# EAGLE design BrakeStrobeLights (EAGLE 8.1.0)
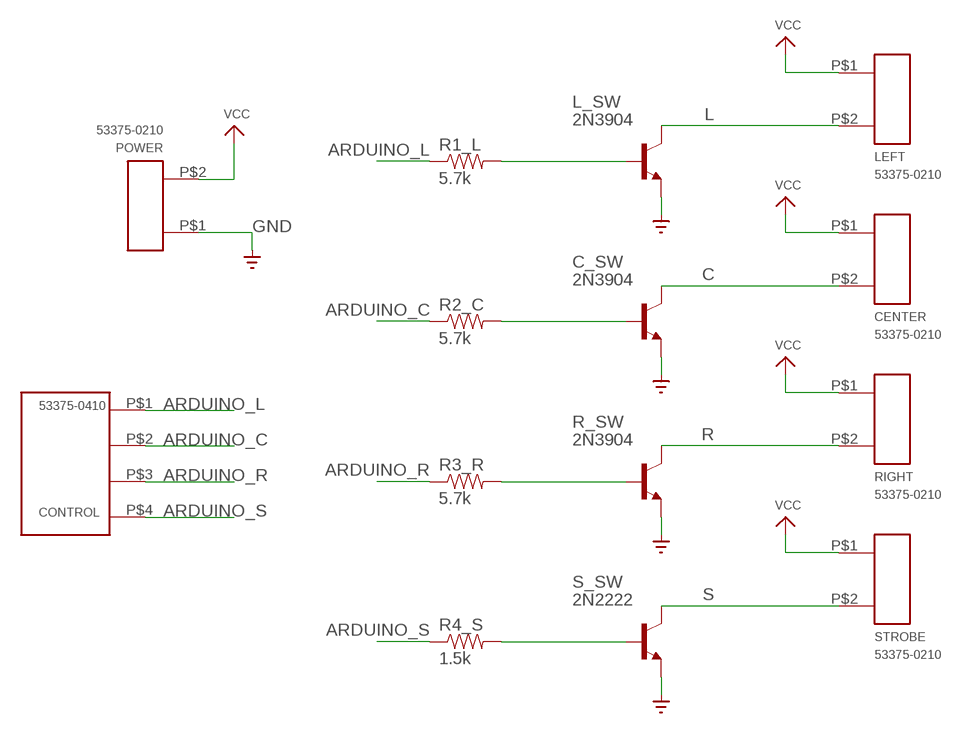
[diagram p0: schematic, sheet 1]

## Parts
C_SW  2N3904  [TO92]
CENTER  53375-0210  [53375-0210-MINI-LOCK]
CONTROL  53375-0410  [53375-0410-MINI-LOCK]
L_SW  2N3904  [TO92]
LEFT  53375-0210  [53375-0210-MINI-LOCK]
POWER  53375-0210  [53375-0210-MINI-LOCK]
R1_L  5.7k  RESISTORPTH-1/6W  [1/6W-RES]
R2_C  5.7k  RESISTORPTH-1/6W  [1/6W-RES]
R3_R  5.7k  RESISTORPTH-1/6W  [1/6W-RES]
R4_S  1.5k  RESISTORPTH-1/6W  [1/6W-RES]
R_SW  2N3904  [TO92]
RIGHT  53375-0210  [53375-0210-MINI-LOCK]
S_SW  2N2222  [TO92-EBC-OVAL]
STROBE  53375-0210  [53375-0210-MINI-LOCK]

## Nets
ARDUINO_C: CONTROL.P$2 R2_C.1
ARDUINO_L: CONTROL.P$1 R1_L.1
ARDUINO_R: CONTROL.P$3 R3_R.1
ARDUINO_S: CONTROL.P$4 R4_S.1
C: C_SW.1(C) CENTER.P$2
GND: C_SW.3(E) L_SW.3(E) POWER.P$1 R_SW.3(E) S_SW.E ; supply symbol labelled GND_
L: L_SW.1(C) LEFT.P$2
N$1: R3_R.2 R_SW.2(B)
N$2: C_SW.2(B) R2_C.2
N$3: R4_S.2 S_SW.B
N$4: L_SW.2(B) R1_L.2
R: R_SW.1(C) RIGHT.P$2
S: S_SW.C STROBE.P$2
VCC: CENTER.P$1 LEFT.P$1 POWER.P$2 RIGHT.P$1 STROBE.P$1

## Library data of the parts
C_SW L_SW R_SW = transistor:2N3904: NPN TRANSISTOR
CENTER LEFT POWER RIGHT STROBE = Hooman:53375-0210: Mini-Lock Header 2 pin 53375 series
CONTROL = Hooman:53375-0410: Mini-Lock Header 4 pin 53375 series
R1_L R2_C R3_R R4_S = SparkFun-Resistors:RESISTOR: Resistor Basic schematic elements and footprints for 0603, 1206, and PTH resistors.
S_SW = adafruit:2N2222: NPN TRANSISTOR Big oval pads

## Board
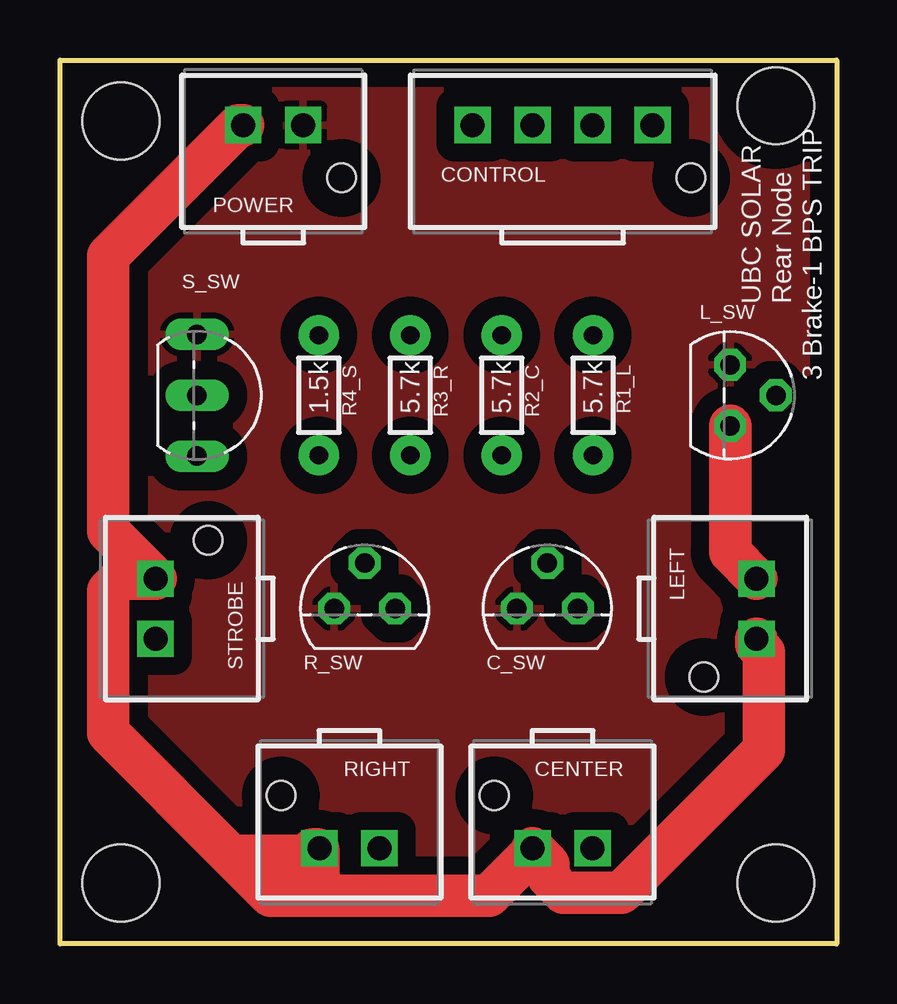
[diagram p1: board, top side]
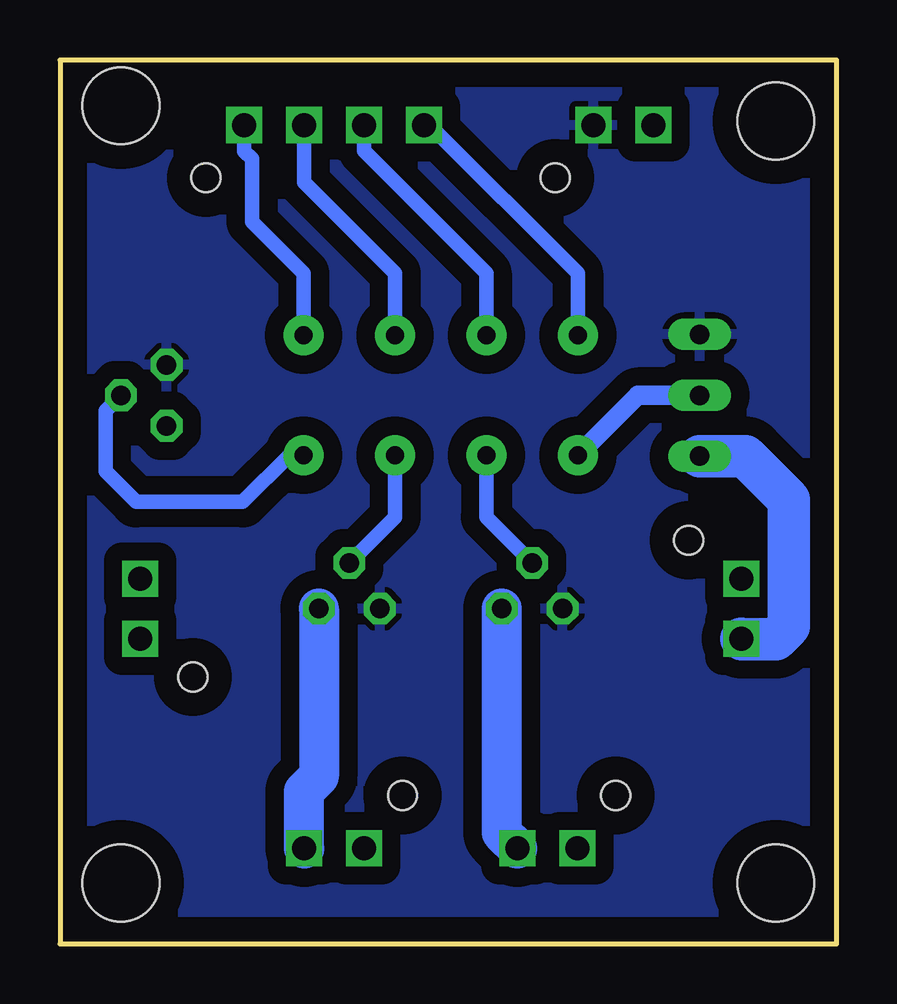
[diagram p2: board, bottom side, seen from below]

Size 32.38 x 36.83 mm. Coordinates in mm from the lower left corner, seen from the top.
Outline: 0,0 0,36.83 32.38,36.83 32.38,0 0,0
Copper layers (1*16): Top 0.035mm / dielectric 1.5mm / Bottom 0.035mm
Design rules "default": minimum track width 10mil, minimum drill 24mil, track to track 8mil, track to pad 8mil, pad to pad 8mil, via to via 8mil, smd to smd 8mil, copper to edge 40mil, drill to drill 8mil, minimum pad ring 10mil, minimum via ring 8mil, stop-mask expansion 4mil, vias tented up to drill 0mil, thermal gap 10mil
Holes 3.2 mm at 29.84,2.54 2.54,2.54 2.54,34.29 29.84,34.92
tKeepout: area 0,36.8 to 33,38.1; area 32.4,0 to 33.7,38.1; area -1.3,0 to 0,38.1; area -1.3,-1.3 to 33.7,0

### Footprints (pad centres in the part's own frame; a part is rotated, then mirrored left to right if it is on the bottom)
TO92 = drill 0.813 octagon: 1 1.27,0; 2 0,1.905; 3 -1.27,0
53375-0210-MINI-LOCK = drill 1 square: P$1 1.25,1.1; P$2 -1.25,1.1 | hole 1.2: 2.85,-1.1
53375-0410-MINI-LOCK = drill 1 square: P$1 3.75,1.1; P$2 1.25,1.1; P$3 -1.25,1.1; P$4 -3.75,1.1 | hole 1.2: 5.35,-1.1
1/6W-RES = drill 0.762 pad 1.676: 1 -2.5,0; 2 2.5,0
TO92-EBC-OVAL = drill 0.813 long: B 0,-1.27; C 2.54,-1.27; E -2.54,-1.27

### Placement (x,y rotation side)
C_SW  20.32,13.97 0 top
CENTER  20.95,5.08 180 top
CONTROL  20.95,33.02 0 top
L_SW  27.94,22.86 270 top
LEFT  27.94,13.97 270 top
POWER  8.89,33.02 0 top
R1_L  22.23,22.86 270 top
R2_C  18.41,22.86 270 top
R3_R  14.61,22.86 270 top
R4_S  10.79,22.86 270 top
R_SW  12.7,13.97 0 top
RIGHT  12.06,5.08 180 top
S_SW  6.99,22.86 270 top
STROBE  5.08,13.97 90 top

### Tracks (layer width: path | path; a pad name or v marks a point on that pad's centre or on a via)
ARDUINO_C
  Bottom 0.61: CONTROL.P$2 22.2,31.73 18.41,27.94 R2_C.1
ARDUINO_L
  Bottom 0.61: CONTROL.P$1 24.7,33.04 24.38,32.72 24.38,30.1 22.23,27.94 R1_L.1
ARDUINO_R
  Bottom 0.61: CONTROL.P$3 19.7,33.04 14.61,27.94 R3_R.1
ARDUINO_S
  Bottom 0.61: CONTROL.P$4 16.98,34.12 10.79,27.94 R4_S.1
C
  Bottom 1.676: C_SW.1 21.59,6.99 22.23,6.35 22.23,4 CENTER.P$2
GND
  pour Top (isolate 0.762): 0,0 0,36.83 32.38,36.83 32.38,0
  pour Bottom (isolate 0.762): 0,36.83 32.38,36.83 32.38,0 0,0
L
  Top 1.778: L_SW.1 27.94,16.32 LEFT.P$2
N$1
  Bottom 0.61: R3_R.2 14.61,17.78 R_SW.2
N$2
  Bottom 0.61: R2_C.2 18.41,17.78 C_SW.2
N$3
  Bottom 0.813: S_SW.B 8.29,22.86 R4_S.2
N$4
  Bottom 0.61: R1_L.2 22.82,20.36 24.77,18.41 29.21,18.41 30.48,19.68 30.48,22.23 L_SW.2
R
  Bottom 1.676: R_SW.1 13.97,4.63 RIGHT.P$2
S
  Bottom 1.778: S_SW.C 3.81,20.32 2.01,18.52 2.01,13.23 2.54,12.7 3.96,12.7 STROBE.P$2
VCC
  Top 1.676: RIGHT.P$1 10.76,3.98 8.79,2.01 | RIGHT.P$1 10.49,3.98 10.23,3.73 7.54,3.73 7.3,3.49 | RIGHT.P$1 10.81,2.56 10.79,2.54
  Top 1.778: POWER.P$2 7.45,34.12 2.01,28.68 2.01,17.19 3.25,15.95 | 3.25,15.95 STROBE.P$1 2.52,15.22 2.01,14.71 | 2.01,14.71 2.01,8.79 7.3,3.49 8.79,2.01 17.88,2.01 19.7,3.83 CENTER.P$1 20.36,3.33 20.36,2.77 21,2.13 23.41,2.13 29.34,8.07 29.34,12.16 29.04,12.46 LEFT.P$1 | 2.01,14.71 3.25,15.95

### Text on the board
tPlace: UBC SOLAR | Rear Node | 3 Brake-1 BPS TRIP